# EAGLE design HV Vector Board (EAGLE 9.0.1)
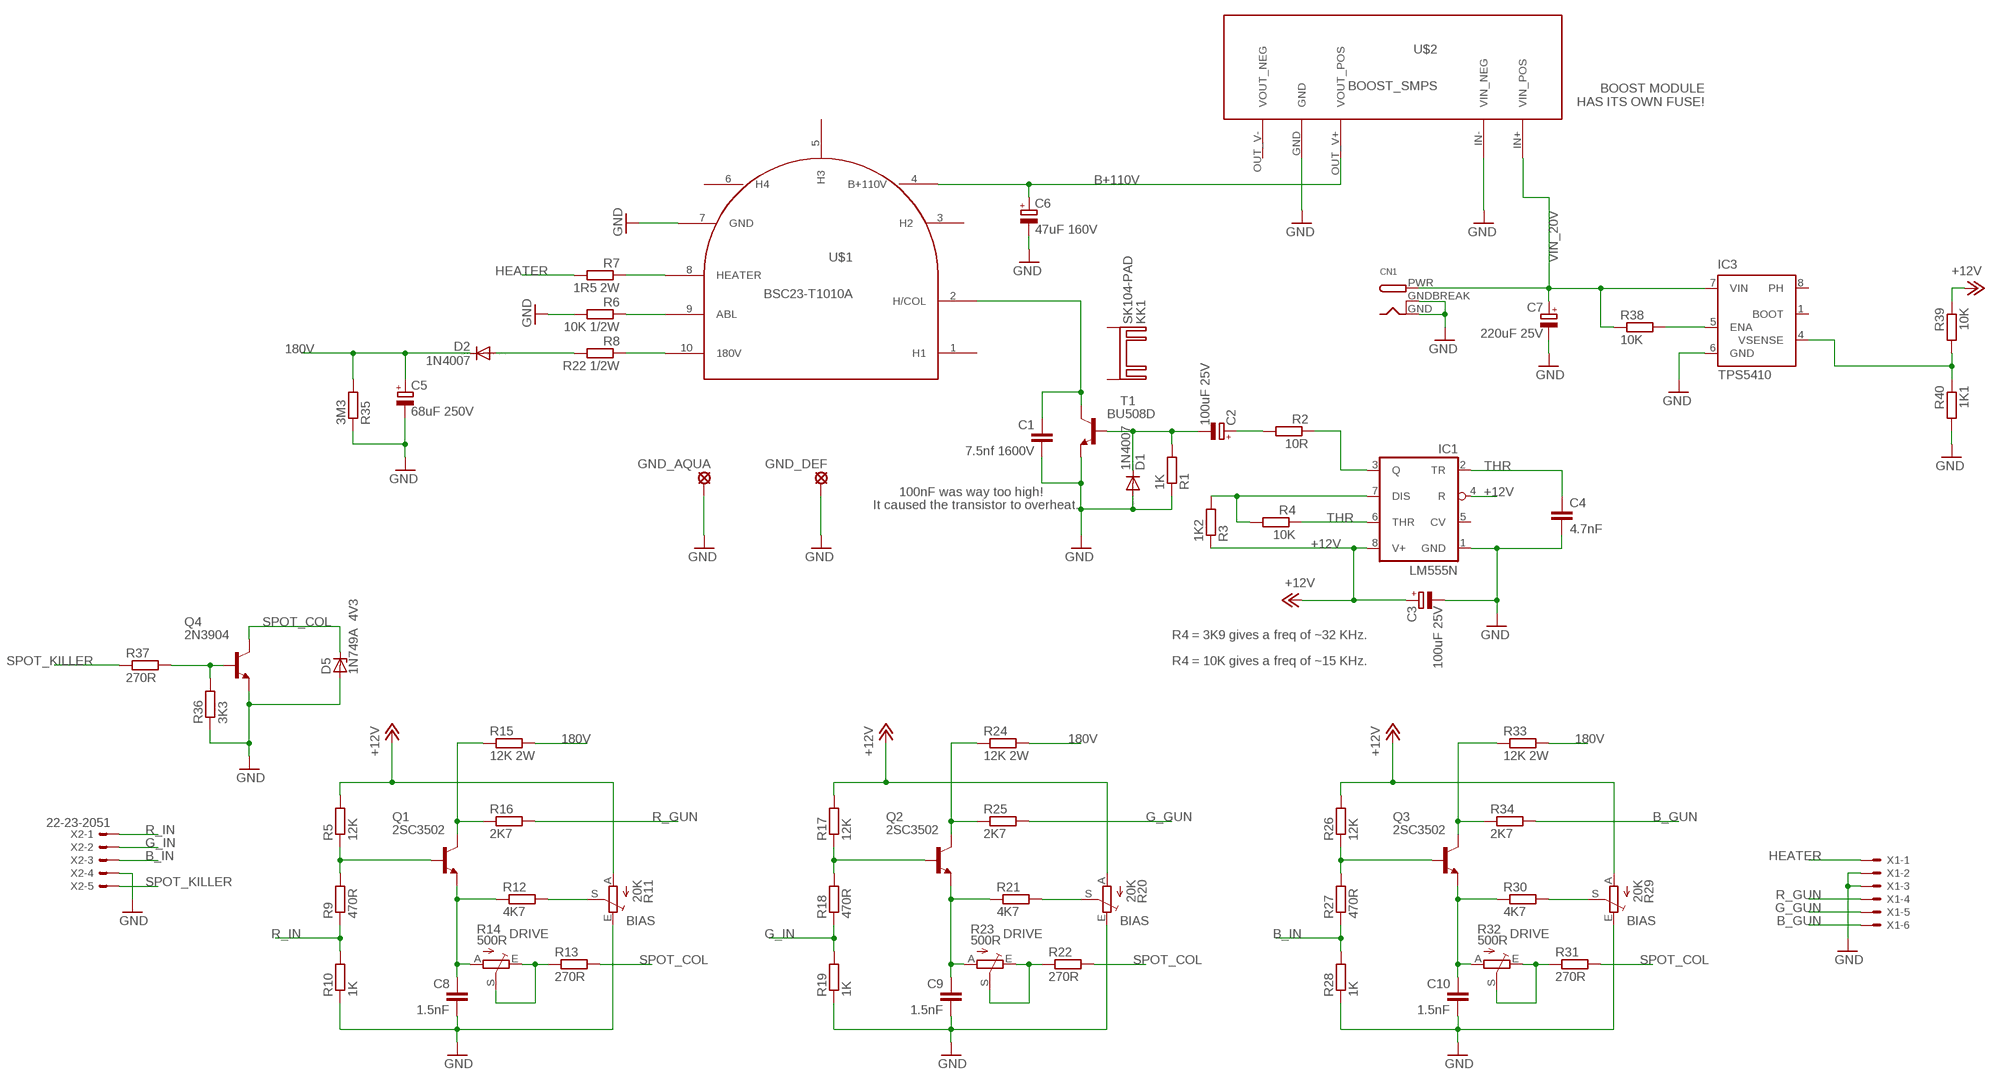
[diagram p0: schematic, sheet 1]

## Parts
C1  7.5nf 1600V  C-EU075-052X106  [C075-052X106]
C2  100uF 25V  CPOL-EUE2-5  [E2-5]
C3  100uF 25V  CPOL-EUE2-5  [E2-5]
C4  4.7nF  C-EU025-025X050  [C025-025X050]
C5  68uF 250V  CPOL-EUE5-8.5  [E5-8,5]
C6  47uF 160V  CPOL-EUE3.5-8  [E3,5-8]
C7  220uF 25V  CPOL-EUE5-8.5  [E5-8,5]
C8  1.5nF  C-EU025-025X050  [C025-025X050]
C9  1.5nF  C-EU025-025X050  [C025-025X050]
C10  1.5nF  C-EU025-025X050  [C025-025X050]
CN1  DCBARRELPTH  [DCJACK_2MM_PTH]
D1  1N4007  1N4004  [DO41-10]
D2  1N4007  1N4004  [DO41-10]
D5  1N749A 4V3  ZENER-DIODEZD-7.5  [ZDIO-7.5]
GND_AQUA  SE14  [SE14]
GND_DEF  SE14  [SE14]
IC1  LM555N  [DIL08]
IC3  TPS5410  [D_R-PDSO-G08]
KK1  SK104-PAD  [SK104-PAD]
Q1  2SC3502  2N4923  [TO126]
Q2  2SC3502  2N4923  [TO126]
Q3  2SC3502  2N4923  [TO126]
Q4  2N3904  [TO92]
R1  1K  R-EU_0207/10  [0207/10]
R2  10R  R-EU_0204/7  [0204/7]
R3  1K2  R-EU_0204/7  [0204/7]
R4  10K  R-EU_0204/7  [0204/7]
R5  12K  R-EU_0204/7  [0204/7]
R6  10K 1/2W  R-EU_0207/10  [0207/10]
R7  1R5 2W  R-EU_0309/12  [0309/12]
R8  R22 1/2W  R-EU_0204/7  [0204/7]
R9  470R  R-EU_0204/7  [0204/7]
R10  1K  R-EU_0204/7  [0204/7]
R11  20K  TRIM_EU-RS3  [RS3]
R12  4K7  R-EU_0204/7  [0204/7]
R13  270R  R-EU_0204/7  [0204/7]
R14  500R  TRIM_EU-RS3  [RS3]
R15  12K 2W  R-EU_0309/12  [0309/12]
R16  2K7  R-EU_0204/7  [0204/7]
R17  12K  R-EU_0204/7  [0204/7]
R18  470R  R-EU_0204/7  [0204/7]
R19  1K  R-EU_0204/7  [0204/7]
R20  20K  TRIM_EU-RS3  [RS3]
R21  4K7  R-EU_0204/7  [0204/7]
R22  270R  R-EU_0204/7  [0204/7]
R23  500R  TRIM_EU-RS3  [RS3]
R24  12K 2W  R-EU_0309/12  [0309/12]
R25  2K7  R-EU_0204/7  [0204/7]
R26  12K  R-EU_0204/7  [0204/7]
R27  470R  R-EU_0204/7  [0204/7]
R28  1K  R-EU_0204/7  [0204/7]
R29  20K  TRIM_EU-RS3  [RS3]
R30  4K7  R-EU_0204/7  [0204/7]
R31  270R  R-EU_0204/7  [0204/7]
R32  500R  TRIM_EU-RS3  [RS3]
R33  12K 2W  R-EU_0309/12  [0309/12]
R34  2K7  R-EU_0204/7  [0204/7]
R35  3M3  R-EU_0204/7  [0204/7]
R36  3K3  R-EU_0204/7  [0204/7]
R37  270R  R-EU_0204/7  [0204/7]
R38  10K  R-EU_0204/7  [0204/7]
R39  10K  R-EU_0204/7  [0204/7]
R40  1K1  R-EU_0204/7  [0204/7]
T1  BU508D  -NPN-TO218V  [TO218V]
U$1  BSC23-T1010A  [BSC25_FLYBACK]
U$2  BOOST_SMPS  [BOOST_PSU]
X1  22-23-2061  [22-23-2061]
X2  22-23-2051  [22-23-2051]

## Nets
180V: C5.+ D2.C R15.2 R24.2 R33.2 R35.2
+12V: C3.+ IC1.4(R) IC1.8(V+) R3.1 R5.2 R11.A R17.2 R20.A R26.2 R29.A R39.1
ABL: R6.1 U$1.9(ABL)
B+110V: C6.+ U$1.4(B+110V) U$2.OUT_V+(VOUT_POS)
B_DRV_WIPE: R31.1 R32.E R32.S
B_GUN: R34.2 X1.6
B_IN: R27.1 R28.2 X2.3
G_DRV_WIPE: R22.1 R23.E R23.S
G_GUN: R25.2 X1.5
G_IN: R18.1 R19.2 X2.2
GND: C1.2 C3.- C4.2 C5.- C6.- C7.- C8.2 C9.2 C10.2 CN1.GND CN1.GNDBREAK D1.A D5.A GND_AQUA.MP GND_DEF.MP IC1.1(GND) IC3.6(GND) Q4.3(E) R1.1 R6.2 R10.1 R11.E R19.1 R20.E R28.1 R29.E R35.1 R36.1 R40.2 T1.3(E) U$1.7(GND) U$2.GND U$2.IN-(VIN_NEG) X1.2 X1.3 X2.4
HEATER: R7.2 X1.1
N$1: C1.1 T1.2(C) U$1.2(H/COL)
N$2: R7.1 U$1.8(HEATER)
N$3: C2.- D1.C R1.2 T1.1(B)
N$4: C2.+ R2.2
N$5: IC1.3(Q) R2.1
N$6: Q2.3(B) R17.1 R18.2
N$7: R8.1 U$1.10(180V)
N$8: D2.A R8.2
N$9: Q4.2(B) R36.2 R37.2
N$10: IC1.7(DIS) R3.2 R4.2
N$11: C9.1 Q2.1(E) R21.1 R23.A
N$12: Q1.3(B) R5.1 R9.2
N$13: C8.1 Q1.1(E) R12.1 R14.A
N$14: R11.S R12.2
N$15: IC3.4(VSENSE) R39.2 R40.1
N$16: IC3.5(ENA) R38.2
N$17: Q1.2(C) R15.1 R16.1
N$19: R20.S R21.2
N$22: Q2.2(C) R24.1 R25.1
N$24: Q3.3(B) R26.1 R27.2
N$25: C10.1 Q3.1(E) R30.1 R32.A
N$26: R29.S R30.2
N$29: Q3.2(C) R33.1 R34.1
R_DRV_WIPE: R13.1 R14.E R14.S
R_GUN: R16.2 X1.4
R_IN: R9.1 R10.2 X2.1
SPOT_COL: D5.C Q4.1(C) R13.2 R22.2 R31.2
SPOT_KILLER: R37.1 X2.5
THR: C4.1 IC1.2(TR) IC1.6(THR) R4.1
VIN_20V: C7.+ CN1.PWR IC3.7(VIN) R38.1 U$2.IN+(VIN_POS)
Unconnected: IC1.5(CV) IC3.1(BOOT) IC3.8(PH) KK1.K1(K) KK1.K2(K) U$1.1(H1) U$1.3(H2) U$1.5(H3) U$1.6(H4) U$2.OUT_V-(VOUT_NEG)

## Notes on the sheet
- BOOST MODULE
  HAS ITS OWN FUSE!
- 100nF was way too high!
- It caused the transistor to overheat.
- R4 = 3K9 gives a freq of ~32 KHz.
- R4 = 10K gives a freq of ~15 KHz.
- BIAS | BIAS | BIAS
- DRIVE | DRIVE | DRIVE

## Library data of the parts
C1 C4 C8-C10 = rcl:C-EU: CAPACITOR, European symbol
C2 C3 C5-C7 = rcl:CPOL-EU: POLARIZED CAPACITOR, European symbol
CN1 = adafruit:DCBARREL: 2.0mm DC Barrel Jack DCJACK_2MM_PTH - Through Hole Jack (4UConnector: 05537)
D1 D2 = diode:1N4004: DIODE general purpose rectifier, 1 A
D5 = diode:ZENER-DIODE: Z-Diode
GND_AQUA GND_DEF = solpad:SE14: SOLDER PAD E1553, drill 1,4mm, distributor Buerklin, 07F820
IC1 = linear:*555: TIMER
IC3 = texas:TPS5410: 1-A, WIDE INPUT RANGE, STEP-DOWN SWIFT? CONVERTER Source: U7 Texas TPS5410 Step Down Converter.pdf; MPN: TPS5410DR; OC_FARNELL: 1329596; OC_NEWARK: 18M3223
KK1 = heatsink:SK104-PAD: HEATSINK manufacturer Fischer/distributor Buerklin
Q1-Q3 = transistor-npn:2N4923: NPN Transistor
Q4 = transistor-npn:2N3904: NPN Transistor
R1-R10 R12 R13 R15-R19 R21 R22 R24-R28 R30 R31 R33-R40 = rcl:R-EU_: RESISTOR, European symbol
R11 R14 R20 R23 R29 R32 = pot:TRIM_EU-: POTENTIOMETER
T1 = transistor:*-NPN-: NPN Transistror BF959 corrected 2008.03.06
U$1 = hv_board:BSC23-T1010A
U$2 = hv_board:BOOST_SMPS
X1 = con-molex:22-23-2061: .100" (2.54mm) Center Header - 6 Pin; MF: MOLEX; MPN: 22-23-2061; OC_FARNELL: 1462922; OC_NEWARK: 27C1933
X2 = con-molex:22-23-2051: .100" (2.54mm) Center Header - 5 Pin; MF: MOLEX; MPN: 22-23-2051; OC_FARNELL: 1462952; OC_NEWARK: 38C9178

## Board
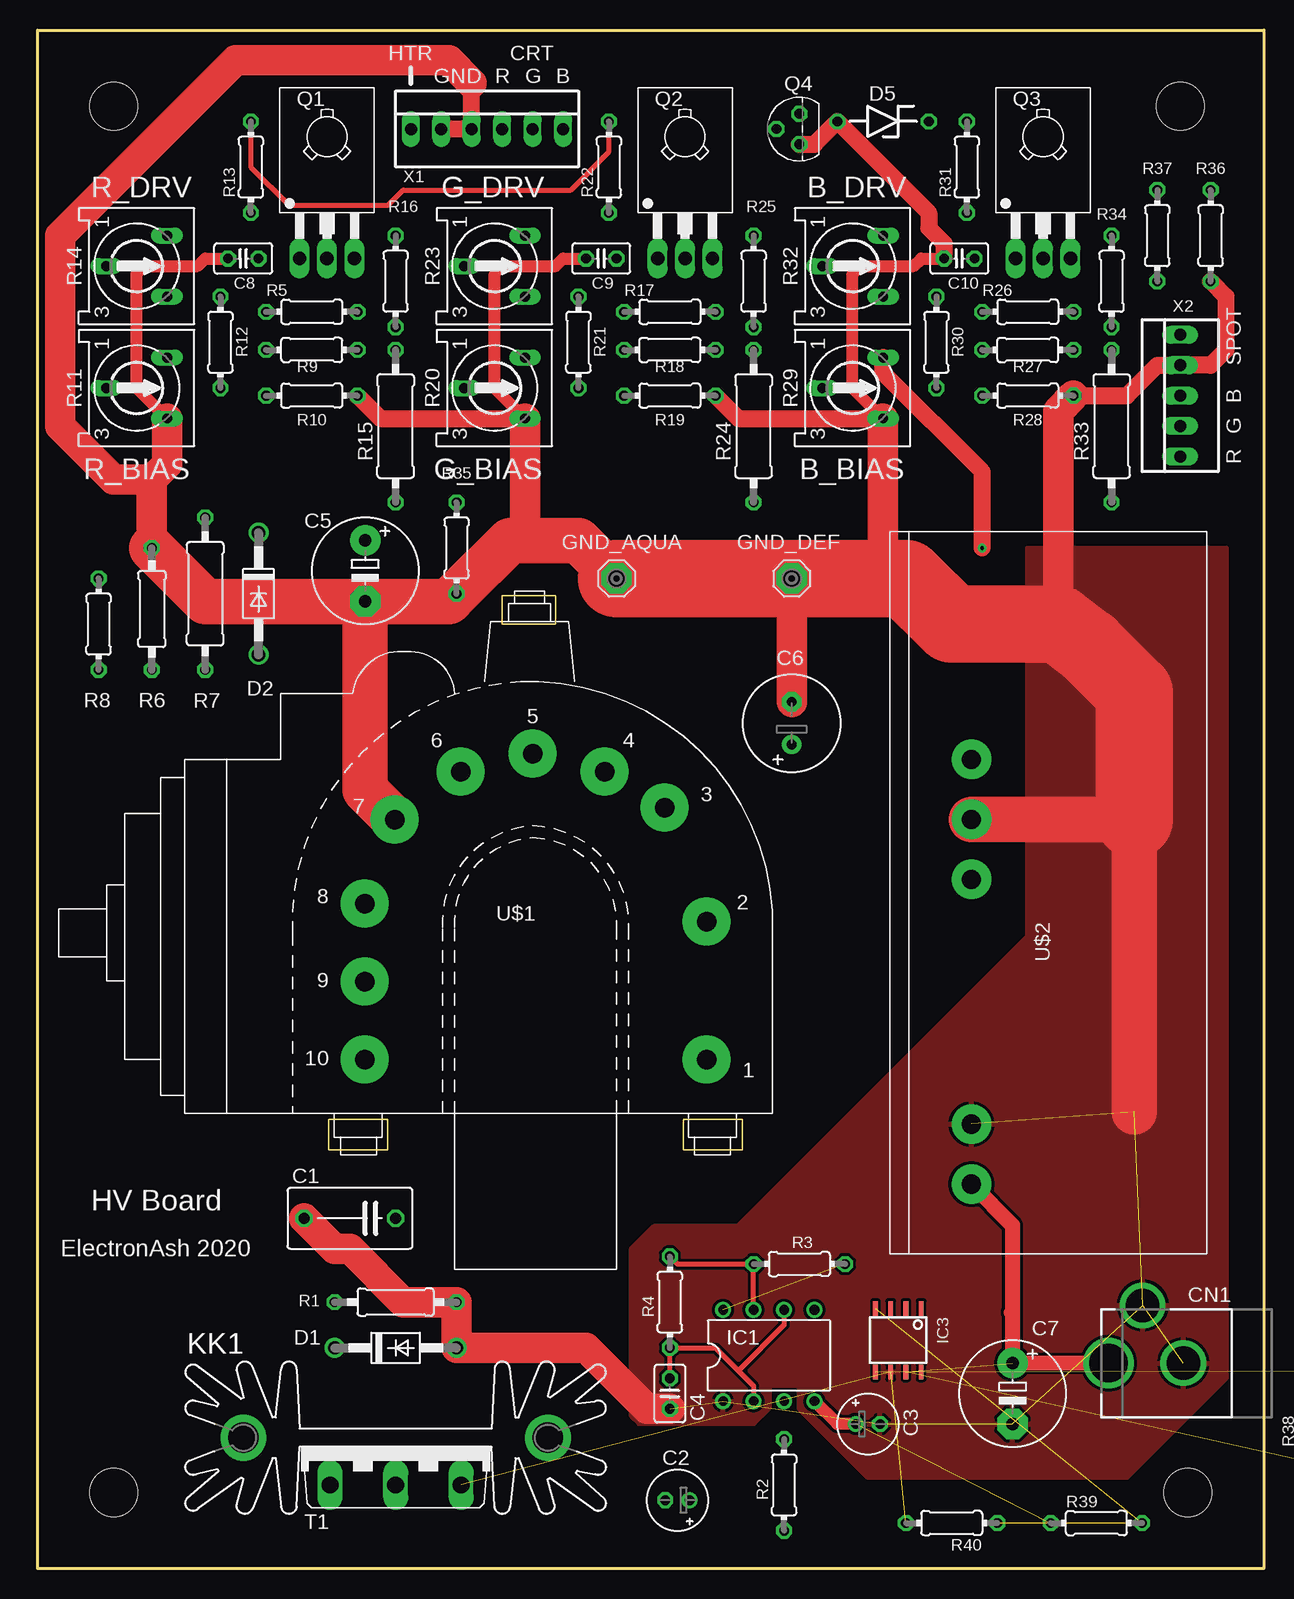
[diagram p1: board, top side]
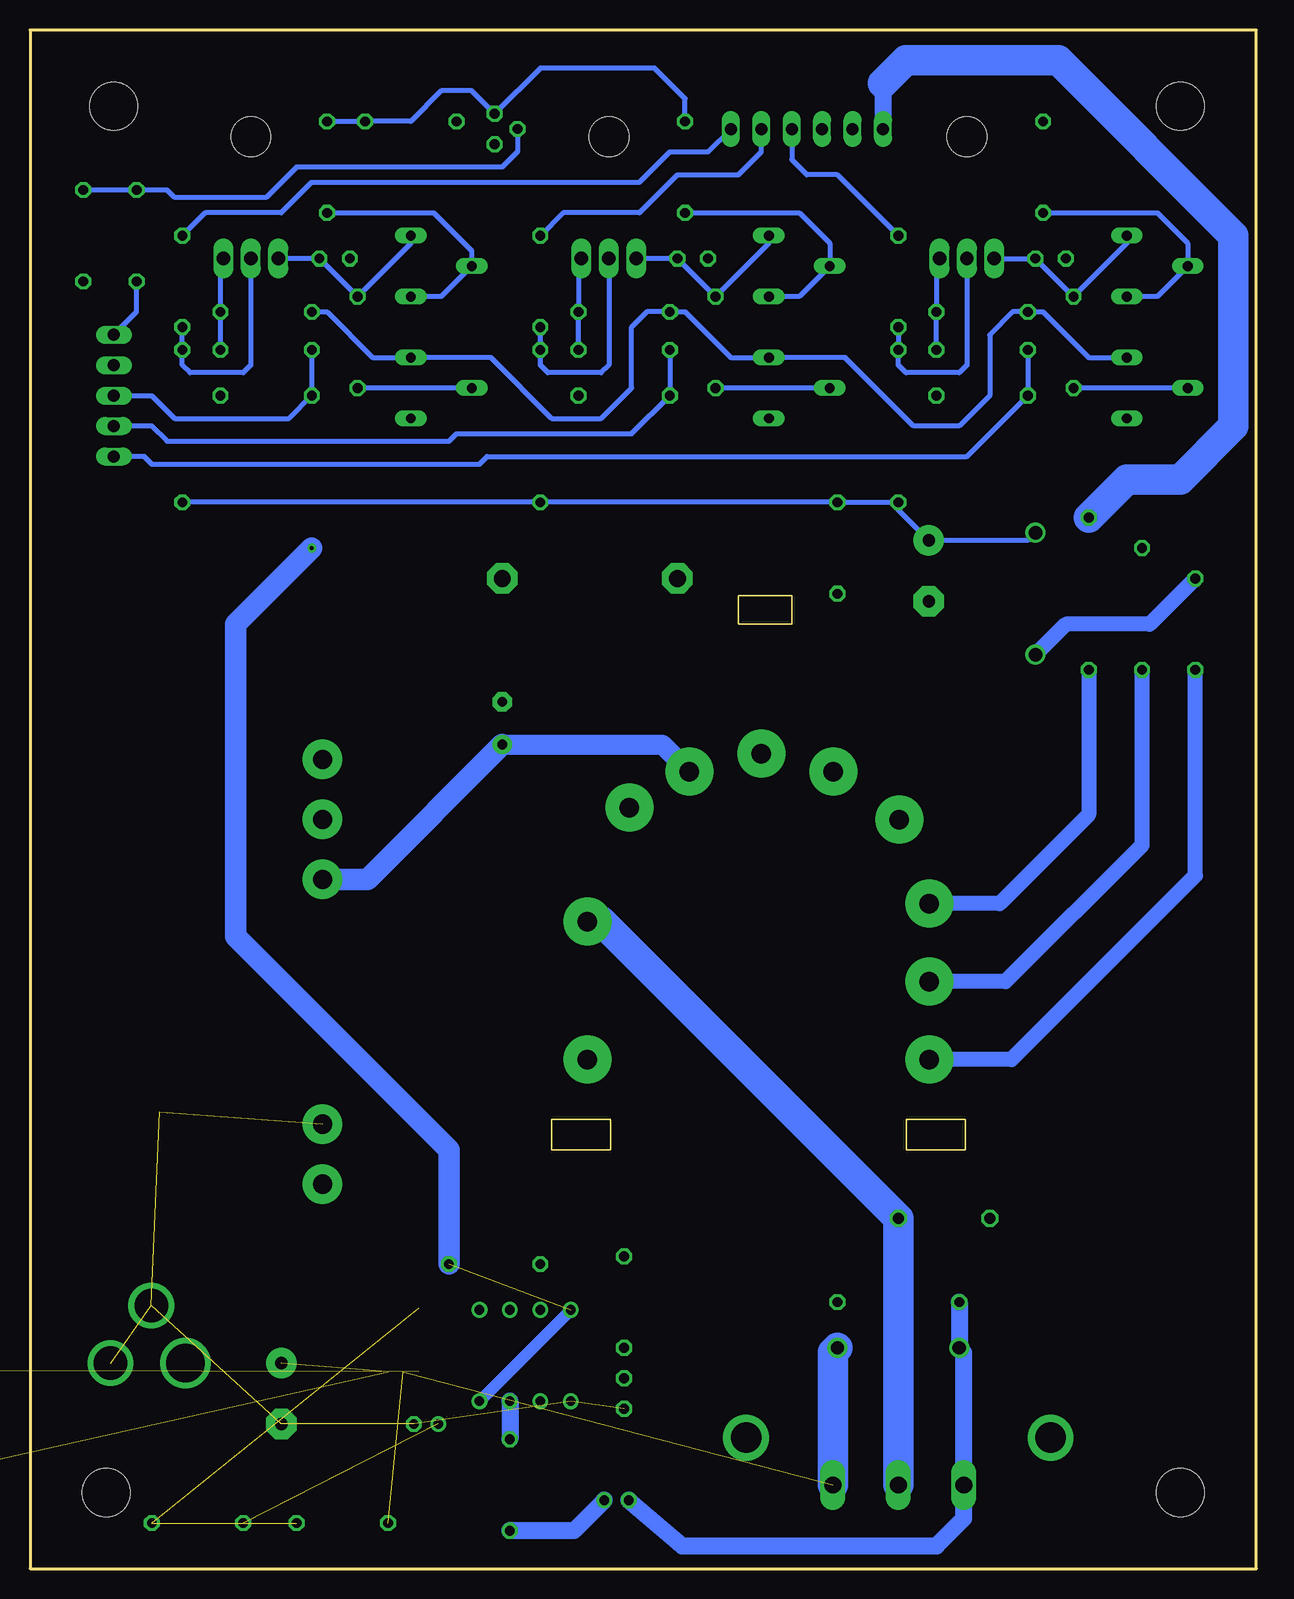
[diagram p2: board, bottom side, seen from below]

Size 102.23 x 128.27 mm. Coordinates in mm from the lower left corner, seen from the top.
Outline: 0,128.27 102.23,128.27 102.23,0 0,0 0,128.27
Copper layers (1*16): Top 0.035mm / dielectric 1.5mm / Bottom 0.035mm
Design rules "default *": minimum track width 5mil, minimum drill 12mil, track to track 10mil, track to pad 10mil, pad to pad 10mil, via to via 10mil, smd to smd 10mil, copper to edge 20mil, drill to drill 8mil, minimum pad ring 10mil, minimum via ring 8mil, stop-mask expansion 4mil, vias tented up to drill 0mil, thermal gap 10mil
Holes 4 mm at 6.35,121.92 6.35,6.35 95.89,6.35 95.25,121.92

### Footprints (pad centres in the part's own frame; a part is rotated, then mirrored left to right if it is on the bottom)
C075-052X106 = drill 0.914 octagon: 1 -3.81,0; 2 3.81,0
E2-5 = drill 0.813 pad 1.27: + -1.016,0 | drill 0.813 pad 1.27 octagon: - 1.016,0
C025-025X050 = drill 0.813 octagon: 1 -1.27,0; 2 1.27,0
E5-8,5 = drill 1.016 pad 2.54: + -2.54,0 | drill 1.016 pad 2.54 octagon: - 2.54,0
E3,5-8 = drill 0.813 pad 1.6: + -1.778,0 | drill 0.813 pad 1.6 octagon: - 1.778,0
DCJACK_2MM_PTH = drill 2.8: GND 0,7.35; GNDBREAK 4.8,10.75 | drill 3.2: PWR 0,13.6
DO41-10 = drill 1.118: A 5.08,0; C -5.08,0
ZDIO-7.5 = drill 0.813 octagon: A 3.81,0; C -3.81,0
SE14 = drill 1.397 pad 2.54 octagon: MP 0,0
DIL08 = drill 0.813 pad 1.27: 1 -3.81,-3.81; 2 -1.27,-3.81; 3 1.27,-3.81; 4 3.81,-3.81; 5 3.81,3.81; 6 1.27,3.81; 7 -1.27,3.81; 8 -3.81,3.81
D_R-PDSO-G08 = smd 0.4 x 1.2: 1 -1.905,-2.65; 2 -0.635,-2.65; 3 0.635,-2.65; 4 1.905,-2.65; 5 1.905,2.65; 6 0.635,2.65; 7 -0.635,2.65; 8 -1.905,2.65
SK104-PAD = drill 2.54 pad 3.81: K1 -12.7,-0.762; K2 12.7,-0.762
TO126 = drill 1.118 long: 1 -2.286,-5.08; 2 0,-5.08; 3 2.286,-5.08 | hole 3.302: 0,5.08
TO92 = drill 0.813 octagon: 1 1.27,0; 2 0,1.905; 3 -1.27,0
0207/10 = drill 0.813 octagon: 1 -5.08,0; 2 5.08,0
0204/7 = drill 0.813 octagon: 1 -3.81,0; 2 3.81,0
0309/12 = drill 0.813 octagon: 1 -6.35,0; 2 6.35,0
RS3 = drill 0.813 long: A -2.54,2.54; E 2.54,2.54; S 0,-2.54
TO218V = drill 1.397 long: 1 -5.461,-3.175; 2 0,-3.175; 3 5.461,-3.175
BSC25_FLYBACK = drill 1.6 pad 4: 1 14.5,-14.07; 2 14.5,-2.57; 3 11,6.93; 4 6,9.93; 5 0,11.43; 6 -6,9.93; 7 -11.5,5.93; 8 -14,-1.07; 9 -14,-7.57; 10 -14,-14.07
BOOST_PSU = drill 1.6 pad 3.3: GND 7.86,8.51; IN+ -22.54,8.51; IN- -17.54,8.51; OUT_V+ 2.86,8.51; OUT_V- 12.86,8.51
22-23-2061 = drill 1 long: 1 -6.35,0; 2 -3.81,0; 3 -1.27,0; 4 1.27,0; 5 3.81,0; 6 6.35,0
22-23-2051 = drill 1 long: 1 -5.08,0; 2 -2.54,0; 3 0,0; 4 2.54,0; 5 5.08,0

### Placement (x,y rotation side)
C1  26.04,29.21 180 top
C2  53.34,5.71 180 top
C3  69.22,12.07 0 top
C4  52.7,14.61 270 top
C5  27.3,83.19 270 top
C6  62.87,70.48 90 top
C7  81.28,14.61 270 top
C8  17.14,109.22 180 top
C9  46.99,109.22 180 top
C10  76.84,109.22 180 top
CN1  102.87,17.14 90 top
D1  29.84,18.41 0 top
D2  18.41,81.28 270 top
D5  70.48,120.65 180 top
GND_AQUA  48.26,82.55 0 top
GND_DEF  62.87,82.55 0 top
IC1  60.96,17.78 0 top
IC3  71.76,19.05 180 top
KK1  29.84,10.16 180 top
Q1  24.13,114.3 0 top
Q2  53.97,114.3 0 top
Q3  83.82,114.3 0 top
Q4  63.5,120.02 90 top
R1  29.84,22.22 180 top
R2  62.23,6.99 270 top
R3  63.5,25.4 180 top
R4  52.7,22.22 90 top
R5  22.86,104.78 180 top
R6  9.53,80.01 90 top
R7  13.97,81.28 90 top
R8  5.08,78.74 90 top
R9  22.86,101.6 0 top
R10  22.86,97.79 180 top
R11  8.26,98.42 270 top
R12  15.24,102.23 270 top
R13  17.78,116.84 90 top
R14  8.26,108.58 270 top
R15  29.84,95.25 270 top
R16  29.84,107.31 90 top
R17  52.7,104.78 180 top
R18  52.7,101.6 0 top
R19  52.7,97.79 180 top
R20  38.1,98.42 270 top
R21  45.08,102.23 270 top
R22  47.62,116.84 90 top
R23  38.1,108.58 270 top
R24  59.69,95.25 270 top
R25  59.69,107.31 90 top
R26  82.55,104.78 180 top
R27  82.55,101.6 0 top
R28  82.55,97.79 180 top
R29  67.95,98.42 270 top
R30  74.93,102.23 270 top
R31  77.47,116.84 90 top
R32  67.95,108.58 270 top
R33  89.54,95.25 270 top
R34  89.54,107.31 90 top
R35  34.92,85.09 90 top
R36  97.79,111.12 90 top
R37  93.34,111.12 90 top
R38  106.05,12.7 90 top  (outside the outline)
R39  88.27,3.81 0 top
R40  76.2,3.81 180 top
T1  29.84,10.16 0 top
U$1  41.27,56.52 0 top
U$2  86.36,54.61 90 top
X1  37.46,120.02 0 top
X2  95.25,97.79 90 top

### Tracks (layer width: path | path; a pad name or v marks a point on that pad's centre or on a via)
180V
  Bottom 0.406: D2.C 19.05,85.72 C5.+ 29.84,88.27 R15.2 R35.2 R24.2 R33.2
+12V  (via drill 0.33)  (2 unrouted)
  Top 1.016: C3.+ 66.67,12.07 IC1.4
  Top 1.422: v78.74,85.09 78.74,91.44 70.48,99.69 R29.A
  Bottom 0.406: R26.2 77.47,104.78 73.66,100.97 R29.A 63.82,100.97 58.74,95.89 54.61,95.89 52.07,98.42 52.07,103.5 50.8,104.78 R17.2 47.62,104.78 43.81,100.97 R20.A 34.29,100.97 28.57,95.25 24.77,95.25 22.23,97.79 22.23,102.87 20.32,104.78 R5.2 17.78,104.78 13.97,100.97 R11.A
  Bottom 1.016: IC1.4 IC1.8
  Bottom 1.778: R3.1 67.31,34.92 85.09,52.7 85.09,78.74 v78.74,85.09
ABL
  Bottom 1.27: R6.1 9.53,60.32 20.91,48.95 U$1.9
B+110V
  Bottom 1.676: C6.+ 49.54,68.71 U$1.4
  Bottom 1.778: U$2.OUT_V+ 74.1,57.47 C6.+
B_DRV_WIPE
  Bottom 0.406: R32.E 67.95,106.05 R32.S 65.41,109.86 68.58,113.03 R31.1
B_GUN
  Bottom 0.406: X1.6 45.72,118.11 48.89,118.11 51.43,115.57 78.74,115.57 81.28,113.03 87.63,113.03 R34.2
B_IN
  Bottom 0.406: X2.3 92.08,97.79 90.17,95.89 80.65,95.89 R28.2 R27.1
G_DRV_WIPE
  Bottom 0.406: R23.E 38.1,106.05 R23.S 35.56,110.49 38.1,113.03 R22.1
G_GUN
  Bottom 0.406: X1.5 41.27,118.11 43.18,116.2 48.26,116.2 51.43,113.03 57.78,113.03 R25.2
G_IN
  Bottom 0.406: R18.1 R19.2 52.07,94.61 66.67,94.61 67.31,93.98 90.81,93.98 92.08,95.25 X2.2
GND  (9 unrouted)
  Top 1.016: R11.E 8.26,98.42 8.26,107.95 8.89,108.58 13.34,108.58 13.97,109.22 C8.2 | R20.E 38.1,98.42 38.1,107.95 38.73,108.58 43.18,108.58 43.81,109.22 C9.2 | R29.E 67.95,98.42 67.95,107.95 68.58,108.58 73.03,108.58 73.66,109.22 C10.2
  Top 1.422: R28.1 90.81,97.79 93.34,100.33 X2.4 97.79,100.33 99.06,101.6 99.06,106.05 R36.1 | Q4.3 64.77,118.75 D5.A 74.3,113.03 74.3,111.76 75.56,110.49 C10.2 | R10.1 28.57,95.89 R20.E | R19.1 58.42,95.89 R29.E | 36.2,123.83 X1.3 X1.2
  Top 2.54: C4.2 50.8,13.34 45.72,18.41 D1.A R1.1 30.48,22.22 26.04,26.67 24.77,26.67 C1.2 | R20.E 40.64,85.72 40.64,85.09 | 36.2,123.83 34.29,125.73 16.51,125.73 1.9,111.12 1.9,95.25 6.35,90.8 9.53,90.8 | R11.E 10.79,92.08 9.53,90.8 | R29.E 70.48,83.19 69.85,82.55 | R28.1 85.09,96.52 85.09,78.74 | R6.2 9.53,90.8 | C6.- GND_DEF.MP
  Top 3.81: C5.- 34.29,80.64 R35.1 39.37,85.72 40.64,85.72 45.08,85.72 GND_AQUA.MP | C5.- 13.97,80.64 R6.2 | U$1.7 27.3,64.91 C5.- | U$2.GND 91.44,62.47 91.44,38.1
  Top 6.452: 91.44,62.47 91.44,73.03 87.63,76.83 85.09,78.74 76.2,78.74 72.39,82.55 69.85,82.55 GND_DEF.MP GND_AQUA.MP
  Bottom 2.54: T1.3 35.31,18.03 D1.A
  pour Top: 51.43,28.57 58.42,28.57 82.55,52.7 82.55,85.09 99.06,85.09 99.06,15.88 90.81,7.62 69.22,7.62 63.5,13.34 63.5,15.24 60.96,15.24 60.96,13.34 59.69,12.07 50.16,12.07 49.53,12.7 49.53,26.67
HEATER
  Bottom 1.422: 31.11,123.83 X1.1
  Bottom 2.54: R7.2 10.79,90.8 6.35,90.8 1.9,95.25 1.9,111.12 16.51,125.73 29.21,125.73 31.11,123.83
N$1
  Bottom 2.54: T1.2 C1.1 54.58,53.95 U$1.2
N$2
  Bottom 1.27: R7.1 13.97,62.86 21.39,55.45 U$1.8
N$3
  Bottom 1.422: R1.2 D1.C 24.38,18.03 T1.1 24.38,4.19 26.67,1.91 47.88,1.91 C2.-
N$4
  Bottom 1.422: C2.+ 56.9,3.17 R2.2
N$5
  Bottom 1.422: IC1.3 R2.1
N$6
  Bottom 0.406: Q2.3 56.51,108.97 R17.1 R18.2
N$7
  Bottom 1.27: R8.1 5.08,57.78 20.42,42.45 U$1.10
N$8
  Bottom 1.27: R8.2 8.89,78.74 15.88,78.74 D2.A
N$9
  Bottom 0.406: Q4.2 61.59,118.11 62.87,116.84 80.01,116.84 82.55,114.3 90.17,114.3 90.81,114.94 R37.2 R36.2
N$10
  Top 0.406: IC1.7 R3.2 53.34,25.4 R4.2
N$11
  Bottom 0.406: Q2.1 C9.1 R21.1 40.64,110.49 R23.A
N$12
  Bottom 0.406: Q1.3 26.67,108.97 R5.1 R9.2
N$13
  Bottom 0.406: Q1.1 C8.1 R12.1 10.79,110.49 R14.A
N$14
  Bottom 0.406: R11.S R12.2
N$15  (2 unrouted)
N$16  (1 unrouted)
N$17
  Bottom 0.406: Q1.2 24.13,100.33 24.77,99.69 29.21,99.69 29.84,100.33 R15.1 R16.1
N$19
  Bottom 0.406: R20.S R21.2
N$22
  Bottom 0.406: Q2.2 53.97,100.33 54.61,99.69 59.05,99.69 59.69,100.33 R24.1 R25.1
N$24
  Bottom 0.406: R27.2 R26.1 86.36,108.97 Q3.3
N$25
  Bottom 0.406: Q3.1 C10.1 R30.1 70.48,110.49 R32.A
N$26
  Bottom 0.406: R29.S R30.2
N$29
  Bottom 0.406: Q3.2 83.82,100.33 84.45,99.69 88.9,99.69 89.54,100.33 R33.1 R34.1
R_DRV_WIPE
  Bottom 0.406: R14.E 8.26,106.05 R14.S 5.71,110.49 8.26,113.03 R13.1
R_GUN
  Bottom 0.406: X1.4 38.73,117.47 37.46,116.2 34.92,116.2 R16.2
R_IN
  Bottom 0.406: R9.1 R10.2 24.13,92.71 64.14,92.71 64.77,92.08 92.08,92.08 92.71,92.71 X2.1
SPOT_COL
  Top 0.406: R13.2 17.78,116.84 20.96,113.66 29.21,113.66 30.48,114.94 44.45,114.94 47.62,118.11 R22.2
  Bottom 0.406: R31.2 D5.C 70.48,120.65 67.95,123.19 65.41,123.19 Q4.1 59.69,125.09 50.16,125.09 47.62,122.55 R22.2
SPOT_KILLER
  Bottom 0.406: X2.5 93.34,104.78 R37.1
THR
  Top 0.406: 58.42,16.51 59.69,15.24 IC1.2 | IC1.6 62.23,20.32 58.42,16.51 | 58.42,16.51 56.51,18.41 R4.1 C4.1
VIN_20V  (2 unrouted)
  Top 1.016: 81.05,21.36 81.28,21.59
  Top 1.27: CN1.PWR C7.+ 81.28,21.59 81.28,28.64 U$2.IN+

### Text on the board
tPlace: HTR | CRT | GND | R | G | B | R_DRV | G_DRV | B_DRV | SPOT | B | G | R | R_BIAS | G_BIAS | B_BIAS | HV Board | ElectronAsh 2020